# Altium project motor-controller.PrjPCB
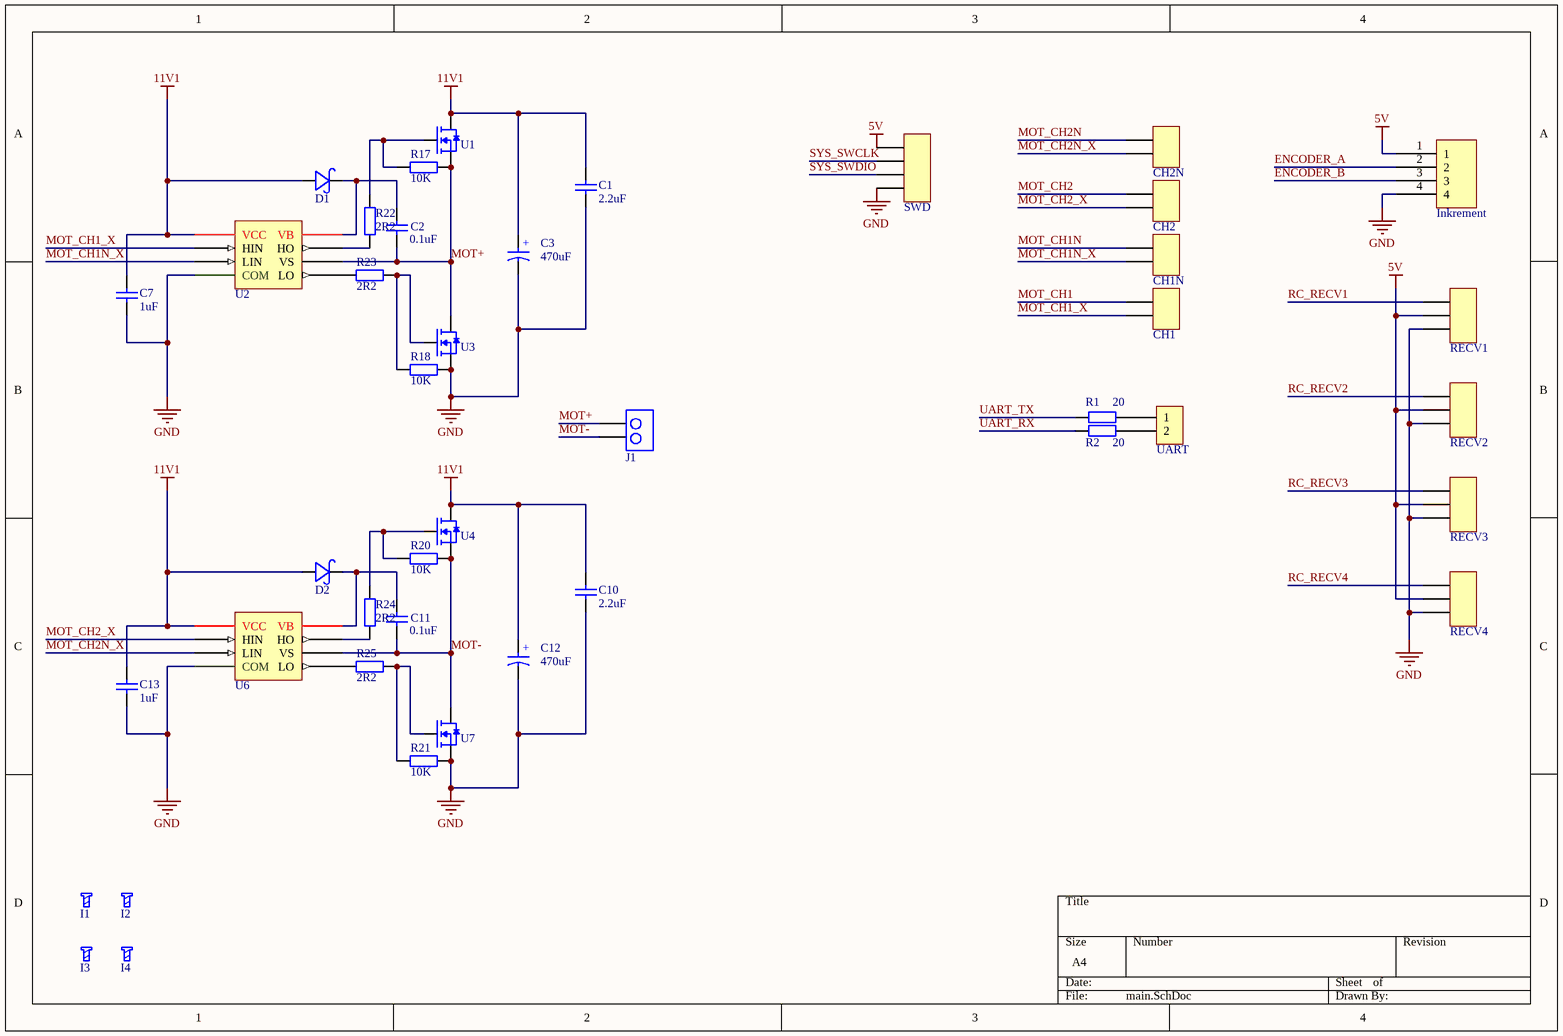
[diagram p0: main.SchDoc]
3 sheets, 105 parts. Net scope: global (net labels, ports and power ports of the same name join across sheets).
Board file: main.PcbDoc
Sheets:
  main.SchDoc
  power.SchDoc
  microcontroller-pinout-motor-controller.SchDoc

## Sheet main.SchDoc
size A4

### Parts
C1  Capacitance: 2.2uF  [10mm lead spacing CAP]  (hidden comment: R60DF4220506AJ)
C2  Capacitance: 0.1uF  [0805]  (hidden comment: VJ0805Y104JXATW1BC)
C3  Capacitance: 470uF  [5mm lead spacing ELCAP]  (hidden comment: EEU-FR1V471)
C7  Capacitance: 1uF  [0805]  (hidden comment: VJ0805Y105KXQTW1BC)
C10  Capacitance: 2.2uF  [10mm lead spacing CAP]  (hidden comment: R60DF4220506AJ)
C11  Capacitance: 0.1uF  [0805]  (hidden comment: VJ0805Y104JXATW1BC)
C12  Capacitance: 470uF  [5mm lead spacing ELCAP]  (hidden comment: EEU-FR1V471)
C13  Capacitance: 1uF  [0805]  (hidden comment: VJ0805Y105KXQTW1BC)
CH1  2-Pin Header  [2-Pin Header]  (value not drawn)
CH1N  2-Pin Header  [2-Pin Header]  (value not drawn)
CH2  2-Pin Header  [2-Pin Header]  (value not drawn)
CH2N  2-Pin Header  [2-Pin Header]  (value not drawn)
D1  SS32A  [DO-214AC(SMA)]  (value not drawn)
D2  SS32A  [DO-214AC(SMA)]  (value not drawn)
I1  M3 screw drillhole  [3mm diameter drill]  (value not drawn)
I2  M3 screw drillhole  [3mm diameter drill]  (value not drawn)
I3  M3 screw drillhole  [3mm diameter drill]  (value not drawn)
I4  M3 screw drillhole  [3mm diameter drill]  (value not drawn)
Inkrement  43-17-42  [43-17-42]  (value not drawn)
J1  1935776  [PT 2,5/ 2-5,0-H]  (value not drawn)
R1  Resistance: 20  [0805]  (hidden comment: CR0805-FX-20R0ELF)
R2  Resistance: 20  [0805]  (hidden comment: CR0805-FX-20R0ELF)
R17  10K  [FP_0805_RES]
R18  10K  [FP_0805_RES]
R20  10K  [FP_0805_RES]
R21  10K  [FP_0805_RES]
R22  2R2  [FP_0805_RES]
R23  2R2  [FP_0805_RES]
R24  2R2  [FP_0805_RES]
R25  2R2  [FP_0805_RES]
RECV1  3-Pin HEADER  [3-Pin HEADER]  (value not drawn)
RECV2  3-Pin HEADER  [3-Pin HEADER]  (value not drawn)
RECV3  3-Pin HEADER  [3-Pin HEADER]  (value not drawn)
RECV4  3-Pin HEADER  [3-Pin HEADER]  (value not drawn)
SWD  4-Pin Header  [4-Pin Header]  (value not drawn)
U1  IRLR8743TRLPBF  [TO-252 (DPAK)]  (value not drawn)
U2  IRS2186STRPBF  [8-Pin SOIC]  (value not drawn)
U3  IRLR8743TRLPBF  [TO-252 (DPAK)]  (value not drawn)
U4  IRLR8743TRLPBF  [TO-252 (DPAK)]  (value not drawn)
U6  IRS2186STRPBF  [8-Pin SOIC]  (value not drawn)
U7  IRLR8743TRLPBF  [TO-252 (DPAK)]  (value not drawn)
UART  2-Pin HEADER  [2-Pin Header]  (value not drawn)

### Nets
5V: Inkrement.1 RECV1.2 RECV2.2 RECV3.2 RECV4.2 SWD.1
11V1: C1.2 C3.1 C7.2 C10.2 C12.1 C13.2 D1.A D2.A U1.D U2.5(VCC) U4.D U6.5(VCC)
GND: C1.1 C3.2 C7.1 C10.1 C12.2 C13.1 Inkrement.4 R18.2 R21.2 RECV1.3 RECV2.3 RECV3.3 RECV4.3 SWD.4 U2.3(COM) U3.S U6.3(COM) U7.S
ENCODER_A: Inkrement.2
ENCODER_B: Inkrement.3
MOT+: C2.1 J1.1 R17.2 U1.S U2.6(VS) U3.D
MOT-: C11.1 J1.2 R20.2 U4.S U6.6(VS) U7.D
MOT_CH1: CH1.1
MOT_CH1_X: CH1.2 U2.1(HIN)
MOT_CH1N: CH1N.1
MOT_CH1N_X: CH1N.2 U2.2(LIN)
MOT_CH2: CH2.1
MOT_CH2_X: CH2.2 U6.1(HIN)
MOT_CH2N: CH2N.1
MOT_CH2N_X: CH2N.2 U6.2(LIN)
RC_RECV1: RECV1.1
RC_RECV2: RECV2.1
RC_RECV3: RECV3.1
RC_RECV4: RECV4.1
SYS_SWCLK: SWD.2
SYS_SWDIO: SWD.3
UART_RX: R2.1
UART_TX: R1.1
NetC2_2: C2.2 D1.K U2.8(VB)
NetC11_2: C11.2 D2.K U6.8(VB)
NetR1_2: R1.2 UART.1
NetR2_2: R2.2 UART.2
NetR17_1: R17.1 R22.2 U1.G
NetR18_1: R18.1 R23.1 U3.G
NetR20_1: R20.1 R24.2 U4.G
NetR21_1: R21.1 R25.1 U7.G
NetR22_1: R22.1 U2.7(HO)
NetR23_2: R23.2 U2.4(LO)
NetR24_1: R24.1 U6.7(HO)
NetR25_2: R25.2 U6.4(LO)

### Notes on the sheet
- (in symbol EEU-FR1V471) +

### Library data of the parts
C1 C10 = R60DF4220506AJ: General Purpose Metallized Polyester Film Capacitor, 2.2 uF, 40 VAC, 63 VDC , 5 %
C2 C11 = VJ0805Y104JXATW1BC: SMD Multilayer Ceramic Capacitor, 0805 [2012 Metric], 0.1 µF, 50 V, ± 5%, X7R, VJ Series
C3 C12 = EEU-FR1V471: Aluminum Electrolytic Capacitors, 470uF, Low ESR
C7 C13 = VJ0805Y105KXQTW1BC: SMD Multilayer Ceramic Capacitor, 0805 [2012 Metric], 1 µF, 10 V, ± 10%, X7R, VJ Series
CH1 CH1N CH2 CH2N = 2-Pin Header: TÜSKESOR 2 P SMD SPHSS220-B02-4/3 (T-T) 2mm PIN 0.5x0.5 TÖRDELHETÖ [ 43-10-37 ]
D1 D2 = SS32A: 3A 40V DO-214AC SCH.RECT. SS34A (YET) SMA (SK34A;SX34) [ 83-02-56 ]
I1-I4 = M3 screw drillhole: 5mm diameter via with 3mm hole
Inkrement = 43-17-42: TÁPCSATL. 2.00mm 4P APA 90° NCW200S-04R (G-S) FORR. [ 43-17-42 ]
J1 = 1935776: PCB terminal block, nominal current: 32 A, nom. voltage: 400 V, pitch: 5 mm, number of positions: 2
R1 R2 = CR0805-FX-20R0ELF: Thick Film Resistors - SMD 20ohm 1%
R17 R18 R20 R21 = RES 10K: Resistor; Tolerance: 5%; Power: 125mW; Name: YAGEO (PHYCOMP)  RC0805JR-0710KL  SMD Chip Resistor, Thick Film, 10 kohm; Reference: 9234136; Supplier: Farnell; Value: 10K
R22 = RES 2R2: Resistor; Tolerance: 5%; Reference: 2671001; Power: 125mW; Supplier: Farnell; Value: 2R2
R23-R25 = RES 2R2: Resistor; Tolerance: 5%; Power: 125mW; Reference: 2671001; Supplier: Farnell; Value: 2R2
U1 U3 U4 U7 = IRLR8743TRLPBF: HEXFET2Power MOSFET, Vdss=30V, Rdson=3.1mOhm, Qg=39nC, Id=160A
U2 U6 = IRS2186STRPBF: High and Low Side Driver

## Sheet power.SchDoc
size A3
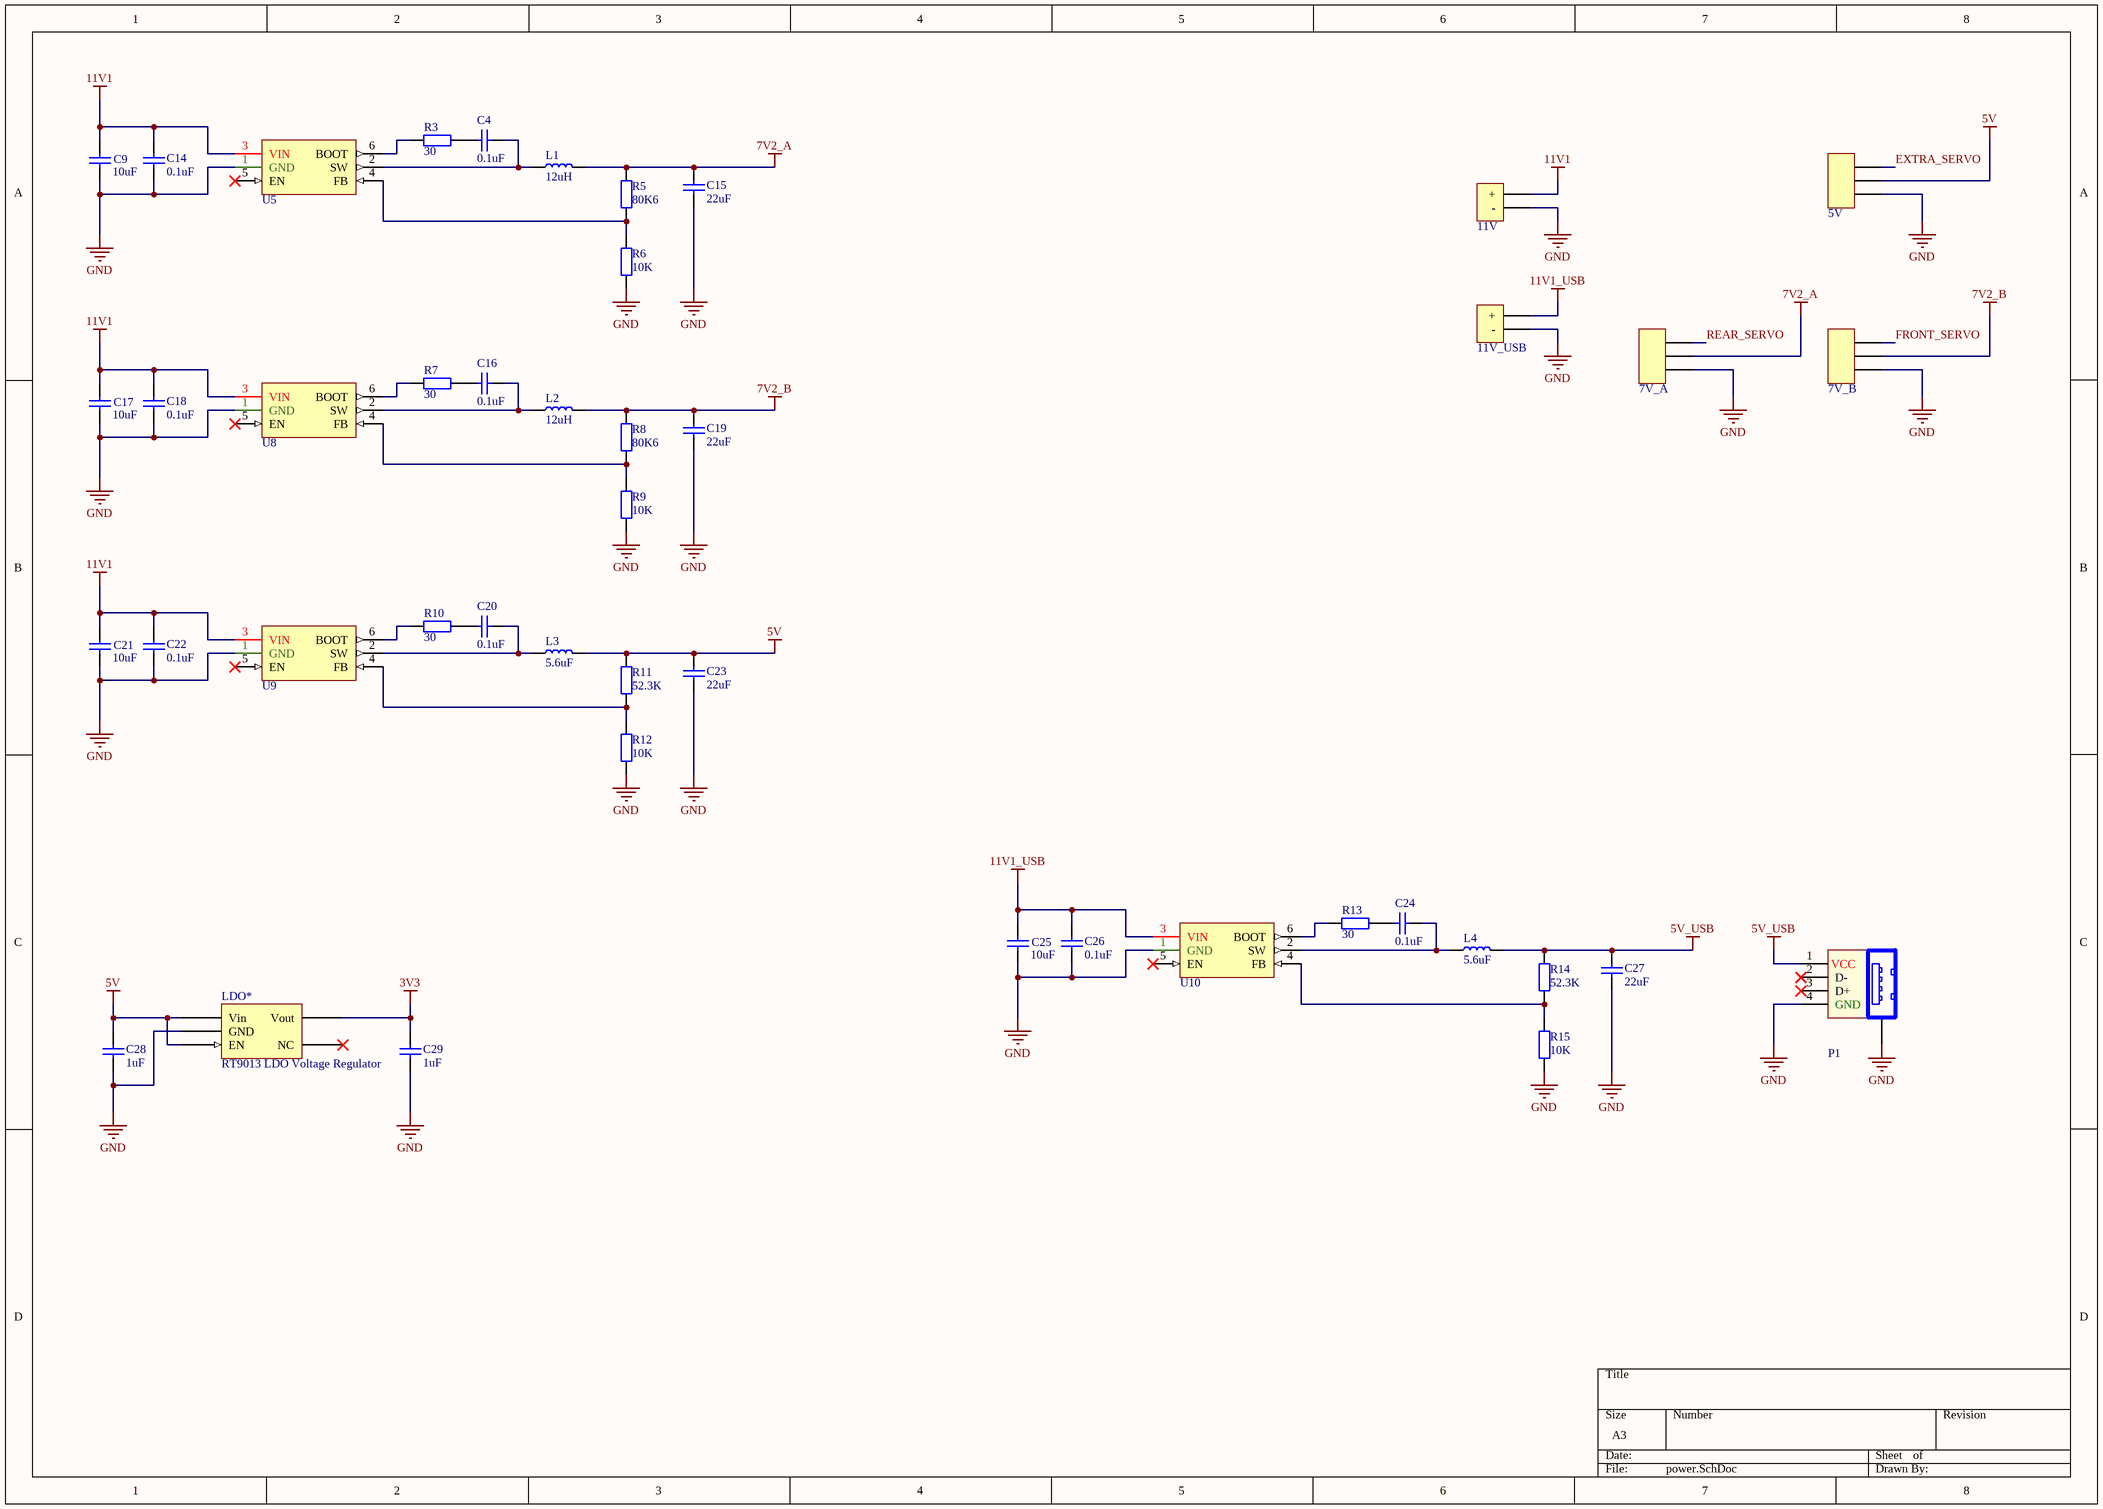
[diagram p1: power.SchDoc]

### Parts
5V  3-Pin HEADER  [3-Pin HEADER]  (value not drawn)
7V_A  3-Pin HEADER  [3-Pin HEADER]  (value not drawn)
7V_B  3-Pin HEADER  [3-Pin HEADER]  (value not drawn)
11V  T_PLUG  [T_plug]  (value not drawn)
11V_USB  T_PLUG  [T_plug]  (value not drawn)
C4  Capacitance: 0.1uF  [0805]  (hidden comment: C0805C104M5RACTU)
C9  Capacitance: 10uF  [0805]  (hidden comment: GRM21BR61E106MA73L)
C14  Capacitance: 0.1uF  [0805]  (hidden comment: C0805C104M5RACTU)
C15  Capacitance: 22uF  [1210]  (hidden comment: TMK325B7226KMHP)
C16  Capacitance: 0.1uF  [0805]  (hidden comment: C0805C104M5RACTU)
C17  Capacitance: 10uF  [0805]  (hidden comment: GRM21BR61E106MA73L)
C18  Capacitance: 0.1uF  [0805]  (hidden comment: C0805C104M5RACTU)
C19  Capacitance: 22uF  [1210]  (hidden comment: TMK325B7226KMHP)
C20  Capacitance: 0.1uF  [0805]  (hidden comment: C0805C104M5RACTU)
C21  Capacitance: 10uF  [0805]  (hidden comment: GRM21BR61E106MA73L)
C22  Capacitance: 0.1uF  [0805]  (hidden comment: C0805C104M5RACTU)
C23  Capacitance: 22uF  [1210]  (hidden comment: TMK325B7226KMHP)
C24  Capacitance: 0.1uF  [0805]  (hidden comment: C0805C104M5RACTU)
C25  Capacitance: 10uF  [0805]  (hidden comment: GRM21BR61E106MA73L)
C26  Capacitance: 0.1uF  [0805]  (hidden comment: C0805C104M5RACTU)
C27  Capacitance: 22uF  [1210]  (hidden comment: TMK325B7226KMHP)
C28  Capacitance: 1uF  [0805]  (hidden comment: VJ0805Y105KXQTW1BC)
C29  Capacitance: 1uF  [0805]  (hidden comment: VJ0805Y105KXQTW1BC)
L1  Inductance: 12uH  [SDR1307]  (hidden comment: SDR1307-120ML)
L2  Inductance: 12uH  [SDR1307]  (hidden comment: SDR1307-120ML)
L3  Inductance: 5.6uF  [SDR1307]  (hidden comment: SDR1307-5R6ML)
L4  Inductance: 5.6uF  [SDR1307]  (hidden comment: SDR1307-5R6ML)
LDO*  RT9013 LDO Voltage Regulator  [RT9013_SOT23]
P1  MC32593  [MC32593]  (value not drawn)
R3  Resistance: 30  [0603_RES]  (hidden comment: RC0603FR-0730RL)
R5  Resistance: 80K6  [0603_RES]  (hidden comment: CRCW060380K6FKEA)
R6  Resistance: 10K  [0603_RES]  (hidden comment: CRCW060310K0FKEA)
R7  Resistance: 30  [0603_RES]  (hidden comment: RC0603FR-0730RL)
R8  Resistance: 80K6  [0603_RES]  (hidden comment: CRCW060380K6FKEA)
R9  Resistance: 10K  [0603_RES]  (hidden comment: CRCW060310K0FKEA)
R10  Resistance: 30  [0603_RES]  (hidden comment: RC0603FR-0730RL)
R11  Resistance: 52.3K  [0603_RES]  (hidden comment: CRCW060352K3FKEA)
R12  Resistance: 10K  [0603_RES]  (hidden comment: CRCW060310K0FKEA)
R13  Resistance: 30  [0603_RES]  (hidden comment: RC0603FR-0730RL)
R14  Resistance: 52.3K  [0603_RES]  (hidden comment: CRCW060352K3FKEA)
R15  Resistance: 10K  [0603_RES]  (hidden comment: CRCW060310K0FKEA)
U5  TPS56339  [SOT-23-Thin-6]  (value not drawn)
U8  TPS56339  [SOT-23-Thin-6]  (value not drawn)
U9  TPS56339  [SOT-23-Thin-6]  (value not drawn)
U10  TPS56339  [SOT-23-Thin-6]  (value not drawn)

### Nets
3V3: C29.2 LDO*.Vout
5V: 5V.2 C23.2 C28.2 L3.2 LDO*.EN LDO*.Vin R11.2
5V_USB: C27.2 L4.2 P1.1(VCC) R14.2
7V2_A: 7V_A.2 C15.2 L1.2 R5.2
7V2_B: 7V_B.2 C19.2 L2.2 R8.2
11V1: 11V.1(+) C9.2 C14.2 C17.2 C18.2 C21.2 C22.2 U5.3(VIN) U8.3(VIN) U9.3(VIN)
11V1_USB: 11V_USB.1(+) C25.2 C26.2 U10.3(VIN)
GND: 5V.3 7V_A.3 7V_B.3 11V.2(-) 11V_USB.2(-) C9.1 C14.1 C15.1 C17.1 C18.1 C19.1 C21.1 C22.1 C23.1 C25.1 C26.1 C27.1 C28.1 C29.1 LDO*.GND P1.0(MNT/GND) P1.4(GND) R6.1 R9.1 R12.1 R15.1 U5.1(GND) U8.1(GND) U9.1(GND) U10.1(GND)
EXTRA_SERVO: 5V.1
FRONT_SERVO: 7V_B.1
REAR_SERVO: 7V_A.1
NetC4_1: C4.1 R3.2
NetC4_2: C4.2 L1.1 U5.2(SW)
NetC16_1: C16.1 R7.2
NetC16_2: C16.2 L2.1 U8.2(SW)
NetC20_1: C20.1 R10.2
NetC20_2: C20.2 L3.1 U9.2(SW)
NetC24_1: C24.1 R13.2
NetC24_2: C24.2 L4.1 U10.2(SW)
NetR3_1: R3.1 U5.6(BOOT)
NetR5_1: R5.1 R6.2 U5.4(FB)
NetR7_1: R7.1 U8.6(BOOT)
NetR8_1: R8.1 R9.2 U8.4(FB)
NetR10_1: R10.1 U9.6(BOOT)
NetR11_1: R11.1 R12.2 U9.4(FB)
NetR13_1: R13.1 U10.6(BOOT)
NetR14_1: R14.1 R15.2 U10.4(FB)

Not connected (* = marked no-connect by the designer): LDO* NC*; P1 2(D-)* 3(D+)*; U5 5(EN)*; U8 5(EN)*; U9 5(EN)*; U10 5(EN)*

### Library data of the parts
11V 11V_USB = T_PLUG: LiPo battery T plug connector
C4 C14 C16 C18 C20 C22 C24 C26 = C0805C104M5RACTU: Multilayer Ceramic Capacitors MLCC - SMD/SMT 50V 0.1uF X7R 0805 20%
C9 C17 C21 C25 = GRM21BR61E106MA73L: Multilayer Ceramic Capacitors MLCC - SMD/SMT 0805 10uF 25volts X5R 20%
C15 C19 C23 C27 = TMK325B7226KMHP: Multilayer Ceramic Capacitors MLCC - SMD/SMT 1210 25V 22uF 10% X7R AEC-Q200
C28 C29 = VJ0805Y105KXQTW1BC: as C7 on sheet main
L1 L2 = SDR1307-120ML: Fixed Inductors 12uH 20% SMD 1307
L3 L4 = SDR1307-5R6ML: Fixed Inductors 5.6uH 20% SMD 1307
LDO* = RT9013: LDO Voltage Regulator
P1 = MC32593: USB Connector, USB Type A, USB 2.0, Receptacle, 4 Ways, Through Hole Mount, Right Angle
R3 R7 R10 R13 = RC0603FR-0730RL: Thick Film Resistors - SMD 30 OHM 1%
R5 R8 = CRCW060380K6FKEA: Thick Film Resistors - SMD 1/10watt 80.6Kohms 1%
R6 R9 R12 R15 = CRCW060310K0FKEA: Thick Film Resistors - SMD 1/10watt 10Kohms 1%
R11 R14 = CRCW060352K3FKEA: Thick Film Resistors - SMD 1/10watt 52.3Kohms 1%
U5 U8-U10 = TPS56339: 4.5-V to 24-V Input, 3-A Output Synchronous Buck Converter

## Sheet microcontroller-pinout-motor-controller.SchDoc
size A
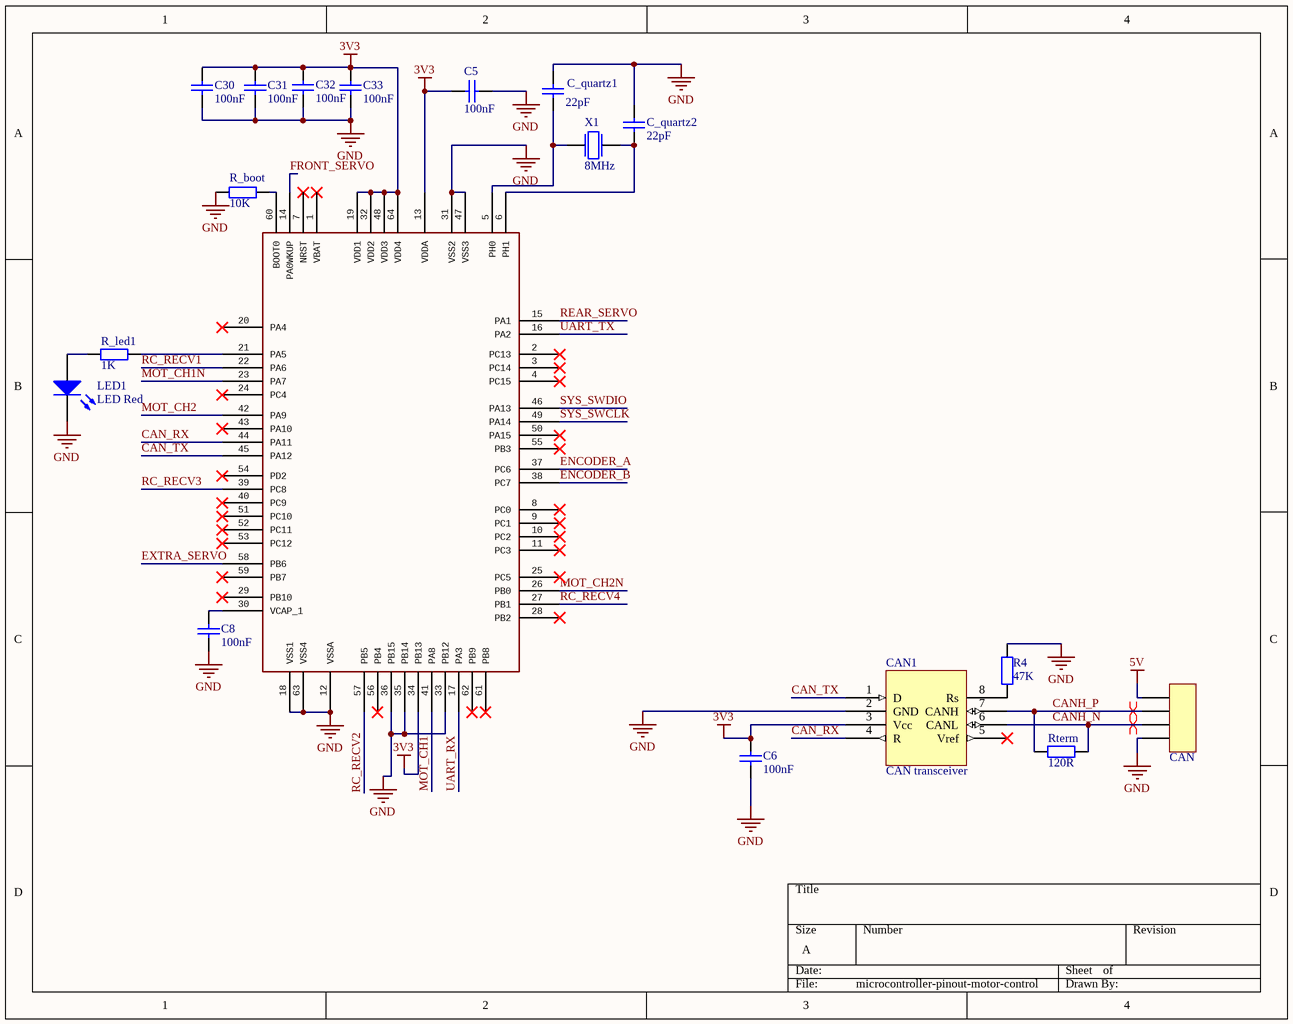
[diagram p2: microcontroller-pinout-motor-controller.SchDoc]

### Parts
1  64-pin STM32F4 chip with symbol for Foxcar Control Board v1.  [LQFP64]  (value not drawn)
C5  100nF  [FP_0805_CAP_085]
C6  100nF  [FP_0805_CAP_085]
C8  100nF  [FP_0805_CAP_085]
C30  100nF  [FP_0805_CAP_085]
C31  100nF  [FP_0805_CAP_085]
C32  100nF  [FP_0805_CAP_085]
C33  100nF  [FP_0805_CAP_085]
C_quartz1  22pF  [FP_0805_CAP_085]
C_quartz2  22pF  [FP_0805_CAP_085]
CAN  4-Pin Header  [4-Pin Header]  (value not drawn)
CAN1  CAN transceiver  [SOIC-8]
LED1  LED Red  [FP_0805_LED_RED]
R4  47K  [FP_0805_RES]
R_boot  10K  [FP_0805_RES]
R_led1  1K  [FP_0805_RES]
Rterm  120R  [FP_0805_RES]
X1  8MHz  [FP_CRYSTAL_HC49_SMD]

### Nets
3V3: 1.13(VDDA) 1.19(VDD1) 1.32(VDD2) 1.34(PB13) 1.48(VDD3) 1.64(VDD4) C5.2 C6.1 C30.2 C31.2 C32.2 C33.2 CAN1.3(Vcc)
5V: CAN.1
GND: 1.12(VSSA) 1.18(VSS1) 1.31(VSS2) 1.33(PB12) 1.35(PB14) 1.36(PB15) 1.47(VSS3) 1.63(VSS4) C5.1 C6.2 C8.1 C30.1 C31.1 C32.1 C33.1 C_quartz1.1 C_quartz2.1 CAN.4 CAN1.2(GND) LED1.2(K) R4.2 R_boot.1
CAN_RX: 1.44(PA11) CAN1.4(R)
CAN_TX: 1.45(PA12) CAN1.1(D)
CANH_N: CAN.3 CAN1.6(CANL) Rterm.2
CANH_P: CAN.2 CAN1.7(CANH) Rterm.1
ENCODER_A: 1.37(PC6)
ENCODER_B: 1.38(PC7)
EXTRA_SERVO: 1.58(PB6)
FRONT_SERVO: 1.14(PA0WKUP)
MOT_CH1: 1.41(PA8)
MOT_CH1N: 1.23(PA7)
MOT_CH2: 1.42(PA9)
MOT_CH2N: 1.26(PB0)
RC_RECV1: 1.22(PA6)
RC_RECV2: 1.57(PB5)
RC_RECV3: 1.39(PC8)
RC_RECV4: 1.27(PB1)
REAR_SERVO: 1.15(PA1)
SYS_SWCLK: 1.49(PA14)
SYS_SWDIO: 1.46(PA13)
UART_RX: 1.17(PA3)
UART_TX: 1.16(PA2)
Net1_5: 1.5(PH0) C_quartz1.2 X1.1
Net1_6: 1.6(PH1) C_quartz2.2 X1.2
Net1_21: 1.21(PA5) R_led1.1
Net1_30: 1.30(VCAP_1) C8.2
Net1_60: 1.60(BOOT0) R_boot.2
NetCAN1_8: CAN1.8(Rs) R4.1
NetLED1_1: LED1.1(A) R_led1.2

Not connected (* = marked no-connect by the designer): 1 1(VBAT)* 2(PC13)* 3(PC14)* 4(PC15)* 7(NRST)* 8(PC0)* 9(PC1)* 10(PC2)* 11(PC3)* 20(PA4)* 24(PC4)* 25(PC5)* 28(PB2)* 29(PB10)* 40(PC9)* 43(PA10)* 50(PA15)* 51(PC10)* 52(PC11)* 53(PC12)* 54(PD2)* 55(PB3)* 56(PB4)* 59(PB7)* 61(PB8)* 62(PB9)*; CAN1 5(Vref)*

### Layout directives
differential pair: CANH_N, CANH_P

### Library data of the parts
1 = STM32F4R_64PIN_FOXCAR: GateName_1: G$1; SymbolName_1: STM32F4_64PINS_FOXCARV1; LibraryName: stm32f4; DeviceSetName: STM32F4R_64PIN_FOXCAR; Package: LQFP64
C5 C6 C8 C30-C33 = CAP 100nF: Capacitor; Tolerance: +80%/-20%; Voltage: 25V; Reference: 1759167; Name: SMD Multilayer Ceramic Capacitor, 0805; Supplier: Farnell; Value: 100nF
C_quartz1 C_quartz2 = CAP 22pF: Capacitor; Tolerance: 5%; Voltage: 50V; Reference: 1759195; Name: SMD Multilayer Ceramic Capacitor, 0805; Supplier: Farnell; Value: 22pF
CAN1 = SN65HVD230
LED1 = LED Red: Red LED; pin to pad: 1>A 2>K; U_fw: 1.85V; I_max: 20mA; Reference: 1581239; Name: MULTICOMP  MCL-S270SRC  LED, Red, SMD, 1.25mm x 1.4mm, 20 mA, 1.85 V, 643 nm; Wavelength: 643nm; Supplier: Farnell
R4 = RES 47K: Resistor; Tolerance: 5%; Power: 125mW; Name: YAGEO (PHYCOMP)  RC0805JR-0747KL  SMD Chip Resistor, Thick Film, 47 kohm; Reference: 9234217; Supplier: Farnell; Value: 47K
R_boot = RES 10K: as R17 on sheet main; Supplier: Farnell; Value: 10K
R_led1 = RES 1K: Resistor; Tolerance: 5%; Power: 125mW; Name: YAGEO (PHYCOMP)  RC0805JR-071KL  SMD Chip Resistor, Thick Film, 1 kohm; Reference: 9234004; Supplier: Farnell; Value: 1K
Rterm = RES 120R: Resistor; Tolerance: 5%; Power: 125mW; Name: YAGEO (PHYCOMP)  RC0805JR-07120RL  SMD Chip Resistor, Thick Film, 120 ohm; Reference: 9233890; Supplier: Farnell; Value: 120R
X1 = Crystal: Quarz Crystal; Value: 8MHz

## Nets that join several sheets
3V3: power (C29.2 LDO*.Vout), microcontroller-pinout-motor-controller (13 pins)
5V: main (6 pins), power (7 pins), microcontroller-pinout-motor-controller (CAN.1)
11V1: main (12 pins), power (10 pins)
GND: main (18 pins), power (30 pins), microcontroller-pinout-motor-controller (22 pins)
ENCODER_A: main (Inkrement.2), microcontroller-pinout-motor-controller (1.37)
ENCODER_B: main (Inkrement.3), microcontroller-pinout-motor-controller (1.38)
EXTRA_SERVO: power (5V.1), microcontroller-pinout-motor-controller (1.58)
FRONT_SERVO: power (7V_B.1), microcontroller-pinout-motor-controller (1.14)
MOT_CH1: main (CH1.1), microcontroller-pinout-motor-controller (1.41)
MOT_CH1N: main (CH1N.1), microcontroller-pinout-motor-controller (1.23)
MOT_CH2: main (CH2.1), microcontroller-pinout-motor-controller (1.42)
MOT_CH2N: main (CH2N.1), microcontroller-pinout-motor-controller (1.26)
RC_RECV1: main (RECV1.1), microcontroller-pinout-motor-controller (1.22)
RC_RECV2: main (RECV2.1), microcontroller-pinout-motor-controller (1.57)
RC_RECV3: main (RECV3.1), microcontroller-pinout-motor-controller (1.39)
RC_RECV4: main (RECV4.1), microcontroller-pinout-motor-controller (1.27)
REAR_SERVO: power (7V_A.1), microcontroller-pinout-motor-controller (1.15)
SYS_SWCLK: main (SWD.2), microcontroller-pinout-motor-controller (1.49)
SYS_SWDIO: main (SWD.3), microcontroller-pinout-motor-controller (1.46)
UART_RX: main (R2.1), microcontroller-pinout-motor-controller (1.17)
UART_TX: main (R1.1), microcontroller-pinout-motor-controller (1.16)